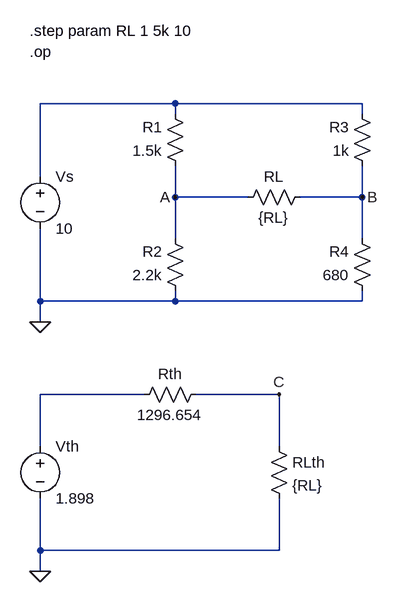
[diagram p0: schematic lab6_v1.asc]
lab6_v1.asc, the LTspice schematic file:
Version 4
SHEET 1 880 896
WIRE 352 160 144 160
WIRE 640 160 352 160
WIRE 352 176 352 160
WIRE 640 176 640 160
WIRE 144 272 144 160
WIRE 352 304 352 256
WIRE 464 304 352 304
WIRE 640 304 640 256
WIRE 640 304 544 304
WIRE 352 368 352 304
WIRE 640 368 640 304
WIRE 144 464 144 352
WIRE 352 464 352 448
WIRE 352 464 144 464
WIRE 640 464 640 448
WIRE 640 464 352 464
WIRE 144 496 144 464
WIRE 304 608 144 608
WIRE 512 608 384 608
WIRE 144 688 144 608
WIRE 512 688 512 608
WIRE 144 848 144 768
WIRE 512 848 512 768
WIRE 512 848 144 848
WIRE 144 880 144 848
FLAG 144 496 0
FLAG 144 880 0
FLAG 512 608 C
FLAG 352 304 A
FLAG 640 304 B
SYMBOL voltage 144 256 R0
SYMATTR InstName Vs
SYMATTR Value 10
SYMBOL res 368 272 R180
WINDOW 0 36 76 Left 2
WINDOW 3 36 40 Left 2
SYMATTR InstName R1
SYMATTR Value 1.5k
SYMBOL res 368 464 R180
WINDOW 0 36 76 Left 2
WINDOW 3 36 40 Left 2
SYMATTR InstName R2
SYMATTR Value 2.2k
SYMBOL res 656 272 R180
WINDOW 0 36 76 Left 2
WINDOW 3 36 40 Left 2
SYMATTR InstName R3
SYMATTR Value 1k
SYMBOL res 656 464 R180
WINDOW 0 36 76 Left 2
WINDOW 3 36 40 Left 2
SYMATTR InstName R4
SYMATTR Value 680
SYMBOL res 448 320 R270
WINDOW 0 32 56 VTop 2
WINDOW 3 0 56 VBottom 2
SYMATTR InstName RL
SYMATTR Value {RL}
SYMBOL voltage 144 672 R0
SYMATTR InstName Vth
SYMATTR Value 1.898
SYMBOL res 400 592 R90
WINDOW 0 0 56 VBottom 2
WINDOW 3 32 56 VTop 2
SYMATTR InstName Rth
SYMATTR Value 1296.654
SYMBOL res 496 672 R0
SYMATTR InstName RLth
SYMATTR Value {RL}
TEXT 128 48 Left 2 !.step param RL 1 5k 10
TEXT 128 80 Left 2 !.op

The netlist it stands for:
* lab6_v1.asc
Vs N001 0 10
R1 A N001 1.5k
R2 0 A 2.2k
R3 B N001 1k
R4 0 B 680
RL A B {RL}
Vth N002 0 1.898
Rth C N002 1296.654
RLth C 0 {RL}
.step param RL 1 5k 10
.op
.backanno
.end